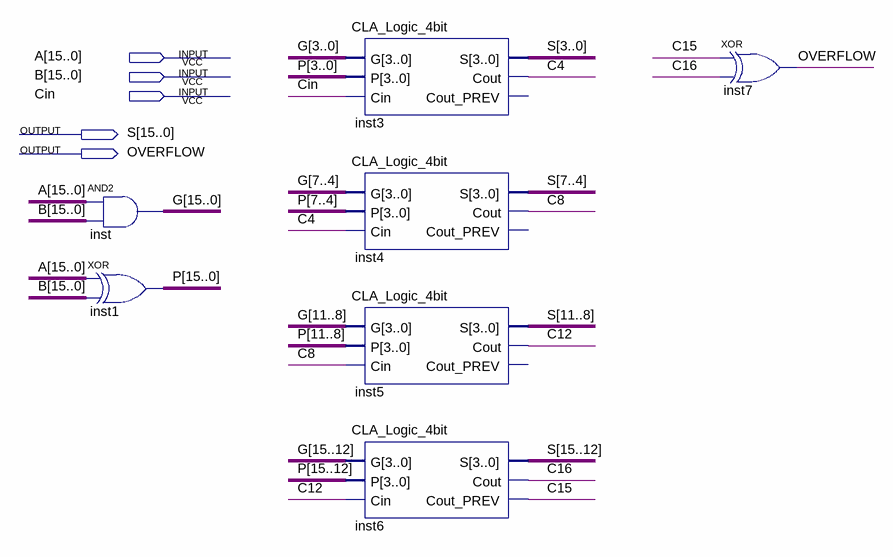
[diagram p0: schematic sheet]
// Quartus schematic CLA_16bit.bdf as structural Verilog: 7 symbols, 5 pins
module CLA_16bit (
  input  [15:0] A,
  input  [15:0] B,
  input  Cin,
  output [15:0] S,
  output OVERFLOW
);

  wire C4, C8, C12, C15, C16;
  wire [15:0] G, P;

  assign G = A & B;  // AND2 inst, 16 bits wide
  assign P = A ^ B;  // XOR inst1, 16 bits wide
  CLA_Logic_4bit inst3 (.G(G[3:0]), .P(P[3:0]), .Cin(Cin), .S(S[3:0]), .Cout(C4));  // open: Cout_PREV
  CLA_Logic_4bit inst4 (.G(G[7:4]), .P(P[7:4]), .Cin(C4), .S(S[7:4]), .Cout(C8));  // open: Cout_PREV
  CLA_Logic_4bit inst5 (.G(G[11:8]), .P(P[11:8]), .Cin(C8), .S(S[11:8]), .Cout(C12));  // open: Cout_PREV
  CLA_Logic_4bit inst6 (.G(G[15:12]), .P(P[15:12]), .Cin(C12), .S(S[15:12]), .Cout(C16), .Cout_PREV(C15));
  xor inst7 (OVERFLOW, C15, C16);
endmodule
